# Altium schematic sheet AuxHalfH.SchDoc: ODRIVE-FOC
size A3; DocumentNumber: SEASKY; Revision: V1.1
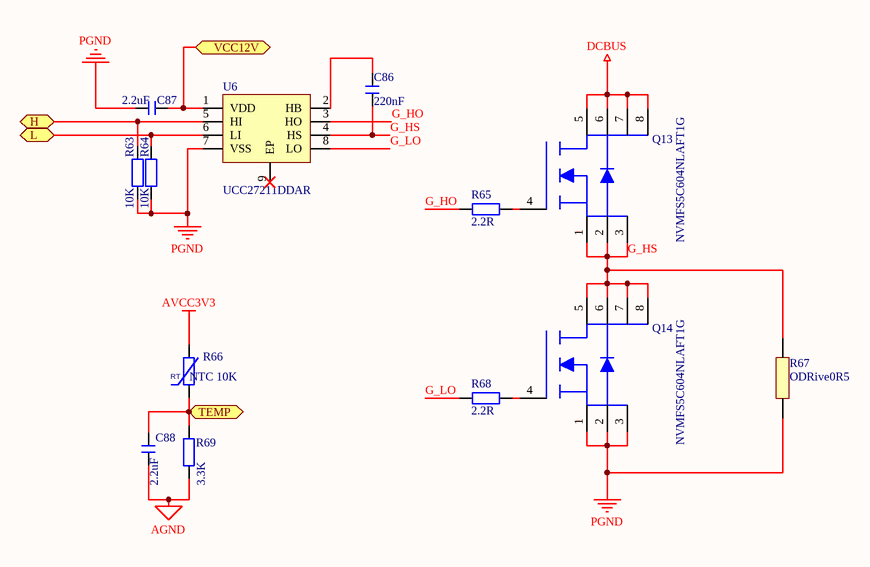
[diagram p0: AuxHalfH.SchDoc]

## Parts
C86  220nF  [C 0805_L]
C87  2.2uF  [C 0603_L]
C88  2.2uF  [C 0603_L]
Q13  NVMFS5C604NLAFT1G  [PG-TDSON-8_L5.0-W6.0-P1.27-LS6.2-BL-EP]
Q14  NVMFS5C604NLAFT1G  [PG-TDSON-8_L5.0-W6.0-P1.27-LS6.2-BL-EP]
R63  10K  [R 0603_L]
R64  10K  [R 0603_L]
R65  2.2R  [R 0603_L]
R66  NTC 10K  [R 0805-HP_L]
R67  ODRive0R5  [ODrive_0R5]
R68  2.2R  [R 0603_L]
R69  3.3K  [R 0805_L]
U6  UCC27211DDAR  [SO-8_EP]

## Ports
H (bidir), L (bidir), TEMP (bidir), VCC12V (bidir)

## Nets
AGND: C88.2 R69.1
AVCC3V3: R66.2
DCBUS: Q13.5 Q13.6 Q13.7 Q13.8
PGND: C87.2 Q14.1 Q14.2 Q14.3 R63.1 R64.1 R67.1 U6.7(VSS)
G_HO: R65.1 U6.3(HO)
G_HS: C86.1 Q13.1 Q13.2 Q13.3 Q14.5 Q14.6 Q14.7 Q14.8 R67.2 U6.4(HS)
G_LO: R68.1 U6.8(LO)
H: R63.2 U6.5(HI) ; port H
L: R64.2 U6.6(LI) ; port L
TEMP: C88.1 R66.1 R69.2 ; port TEMP
VCC12V: C87.1 U6.1(VDD) ; port VCC12V
NetC86_2: C86.2 U6.2(HB)
NetQ13_4: Q13.4 R65.2
NetQ14_4: Q14.4 R68.2

Not connected (* = marked no-connect by the designer): U6 9(EP)*

## Notes on the sheet
- Title
- Size:
- Date:
- A3
- Number:
- Time:
- Revision:
- Sheet
- of
- File:

## Library data of the parts
C86-C88 = C: 贴片电容
Q13 Q14 = BSC037N08NS5ATMA1
R63-R65 R68 R69 = R: 贴片电阻
R66 = RT: 热敏电阻